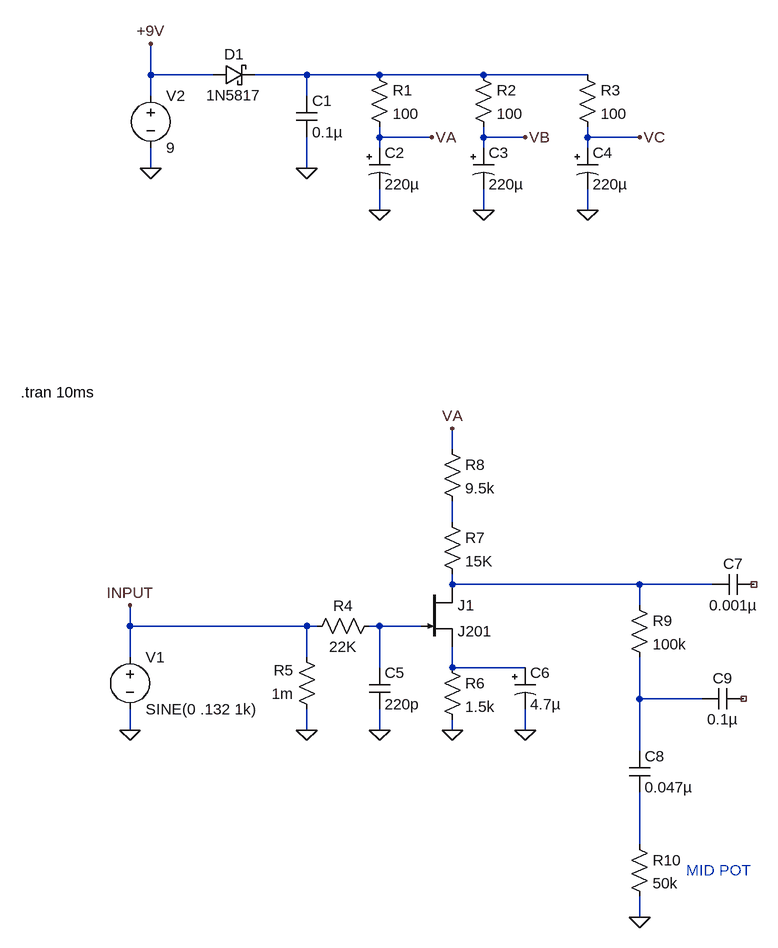
[diagram p0: schematic JM Fetzer Valve.asc]
JM Fetzer Valve.asc, the LTspice schematic file:
Version 4
SHEET 1 880 804
WIRE -640 -512 -640 -560
WIRE -544 -512 -640 -512
WIRE -400 -512 -480 -512
WIRE -288 -512 -400 -512
WIRE -128 -512 -288 -512
WIRE 32 -512 -128 -512
WIRE -640 -480 -640 -512
WIRE -400 -480 -400 -512
WIRE -288 -416 -288 -432
WIRE -208 -416 -288 -416
WIRE -128 -416 -128 -432
WIRE -64 -416 -128 -416
WIRE 32 -416 32 -432
WIRE 112 -416 32 -416
WIRE -288 -400 -288 -416
WIRE -128 -400 -128 -416
WIRE 32 -400 32 -416
WIRE -640 -368 -640 -400
WIRE -400 -368 -400 -416
WIRE -288 -304 -288 -336
WIRE -128 -304 -128 -336
WIRE 32 -304 32 -336
WIRE -176 64 -176 32
WIRE -176 176 -176 144
WIRE -176 272 -176 256
WIRE 112 272 -176 272
WIRE 224 272 112 272
WIRE 112 304 112 272
WIRE -672 336 -672 304
WIRE -400 336 -672 336
WIRE -384 336 -400 336
WIRE -288 336 -304 336
WIRE -224 336 -288 336
WIRE -672 384 -672 336
WIRE -400 384 -400 336
WIRE -288 400 -288 336
WIRE -176 400 -176 368
WIRE -64 400 -176 400
WIRE 112 448 112 384
WIRE 208 448 112 448
WIRE -672 496 -672 464
WIRE -400 496 -400 464
WIRE -288 496 -288 464
WIRE -176 496 -176 480
WIRE -64 496 -64 464
WIRE 112 528 112 448
WIRE 112 672 112 592
WIRE 112 784 112 752
FLAG -672 496 0
FLAG -640 -368 0
FLAG -640 -560 +9V
FLAG -672 304 INPUT
FLAG -400 -368 0
FLAG -288 -304 0
FLAG -128 -304 0
FLAG 32 -304 0
FLAG -208 -416 VA
FLAG -64 -416 VB
FLAG 112 -416 VC
FLAG -400 496 0
FLAG -288 496 0
FLAG -176 496 0
FLAG -64 496 0
FLAG -176 32 VA
FLAG 112 784 0
SYMBOL voltage -672 368 R0
WINDOW 123 0 0 Left 0
WINDOW 39 0 0 Left 0
SYMATTR InstName V1
SYMATTR Value SINE(0 .132 1k)
SYMBOL voltage -640 -496 R0
WINDOW 123 0 0 Left 0
WINDOW 39 0 0 Left 0
SYMATTR InstName V2
SYMATTR Value 9
SYMBOL schottky -544 -496 R270
WINDOW 0 32 32 VTop 2
WINDOW 3 0 32 VBottom 2
SYMATTR InstName D1
SYMATTR Value 1N5817
SYMATTR Description Diode
SYMATTR Type diode
SYMBOL cap -416 -480 R0
SYMATTR InstName C1
SYMATTR Value 0.1µ
SYMATTR SpiceLine V=50 Irms=835m Rser=0.0936732 Lser=0 mfg="KEMET" pn="C1812C104K5RAC" type="X7R"
SYMBOL polcap -304 -400 R0
WINDOW 3 24 56 Left 2
SYMATTR InstName C2
SYMATTR Value 220µ
SYMATTR Description Capacitor
SYMATTR Type cap
SYMATTR SpiceLine V=35 Irms=570m Rser=0.123 Lser=20.8n mfg="Würth Elektronik" pn="865080553014 WCAP-ASLI 8x10,5" type="Al electrolytic"
SYMBOL polcap -144 -400 R0
WINDOW 3 24 56 Left 2
SYMATTR InstName C3
SYMATTR Value 220µ
SYMATTR Description Capacitor
SYMATTR Type cap
SYMATTR SpiceLine V=35 Irms=570m Rser=0.123 Lser=20.8n mfg="Würth Elektronik" pn="865080553014 WCAP-ASLI 8x10,5" type="Al electrolytic"
SYMBOL polcap 16 -400 R0
WINDOW 3 24 56 Left 2
SYMATTR InstName C4
SYMATTR Value 220µ
SYMATTR Description Capacitor
SYMATTR Type cap
SYMATTR SpiceLine V=35 Irms=570m Rser=0.123 Lser=20.8n mfg="Würth Elektronik" pn="865080553014 WCAP-ASLI 8x10,5" type="Al electrolytic"
SYMBOL res -304 -528 R0
SYMATTR InstName R1
SYMATTR Value 100
SYMATTR SpiceLine tol=1 pwr=0.125
SYMBOL res -144 -528 R0
SYMATTR InstName R2
SYMATTR Value 100
SYMATTR SpiceLine tol=1 pwr=0.125
SYMBOL res 16 -528 R0
SYMATTR InstName R3
SYMATTR Value 100
SYMATTR SpiceLine tol=1 pwr=0.125
SYMBOL njf -224 272 R0
SYMATTR InstName J1
SYMATTR Value J201
SYMBOL res -288 320 R90
WINDOW 0 0 56 VBottom 2
WINDOW 3 32 56 VTop 2
SYMATTR InstName R4
SYMATTR Value 22K
SYMATTR SpiceLine tol=1 pwr=0.1
SYMBOL res -384 480 R180
WINDOW 0 36 76 Left 2
WINDOW 3 36 40 Left 2
SYMATTR InstName R5
SYMATTR Value 1m
SYMBOL cap -304 400 R0
SYMATTR InstName C5
SYMATTR Value 220p
SYMATTR SpiceLine V=25 Irms=0 Rser=0.5863 Lser=330p mfg="Würth Elektronik" pn="885012206055 WCAP-CSGP 0603" type="X7R"
SYMBOL res -192 384 R0
SYMATTR InstName R6
SYMATTR Value 1.5k
SYMATTR SpiceLine tol=1 pwr=0.1
SYMBOL polcap -80 400 R0
WINDOW 3 24 56 Left 2
SYMATTR InstName C6
SYMATTR Value 4.7µ
SYMATTR Description Capacitor
SYMATTR Type cap
SYMATTR SpiceLine V=16 Irms=12m Rser=2.7041 Lser=1.39n mfg="Würth Elektronik" pn="865250340002 WCAP-ASNP 4x5,5" type="Al electrolytic"
SYMBOL res -192 160 R0
SYMATTR InstName R7
SYMATTR Value 15K
SYMATTR SpiceLine tol=1 pwr=0.1
SYMBOL res -192 48 R0
SYMATTR InstName R8
SYMATTR Value 9.5k
SYMBOL res 96 288 R0
SYMATTR InstName R9
SYMATTR Value 100k
SYMBOL cap 288 256 R90
WINDOW 0 0 32 VBottom 2
WINDOW 3 32 32 VTop 2
SYMATTR InstName C7
SYMATTR Value 0.001µ
SYMATTR SpiceLine V=25 Irms=0 Rser=0.2145 Lser=153p mfg="Würth Elektronik" pn="885012205044 WCAP-CSGP 0402" type="X7R"
SYMBOL cap 96 528 R0
SYMATTR InstName C8
SYMATTR Value 0.047µ
SYMATTR SpiceLine V=100 Irms=659m Rser=0.0888324 Lser=0 mfg="KEMET" pn="C1825C473K1RAC" type="X7R"
SYMBOL cap 272 432 R90
WINDOW 0 0 32 VBottom 2
WINDOW 3 32 32 VTop 2
SYMATTR InstName C9
SYMATTR Value 0.1µ
SYMATTR SpiceLine V=25 Irms=2.1 Rser=0.0606238 Lser=0 mfg="KEMET" pn="C1210C104K3RAC" type="X7R"
SYMBOL res 96 656 R0
SYMATTR InstName R10
SYMATTR Value 50k
TEXT -840 -24 Left 2 !.tran 10ms
TEXT 184 712 Left 2 ;MID POT

The netlist it stands for:
* JM Fetzer Valve.asc
V1 INPUT 0 SINE(0 .132 1k)
V2 +9V 0 9
D1 +9V N001 1N5817
C1 N001 0 0.1µ V=50 Irms=835m Rser=0.0936732 Lser=0 mfg="KEMET" pn="C1812C104K5RAC" type="X7R"
C2 VA 0 220µ V=35 Irms=570m Rser=0.123 Lser=20.8n mfg="Würth Elektronik" pn="865080553014 WCAP-ASLI 8x10,5" type="Al electrolytic"
C3 VB 0 220µ V=35 Irms=570m Rser=0.123 Lser=20.8n mfg="Würth Elektronik" pn="865080553014 WCAP-ASLI 8x10,5" type="Al electrolytic"
C4 VC 0 220µ V=35 Irms=570m Rser=0.123 Lser=20.8n mfg="Würth Elektronik" pn="865080553014 WCAP-ASLI 8x10,5" type="Al electrolytic"
R1 N001 VA 100 tol=1 pwr=0.125
R2 N001 VB 100 tol=1 pwr=0.125
R3 N001 VC 100 tol=1 pwr=0.125
J1 N003 N004 N005 J201
R4 N004 INPUT 22K tol=1 pwr=0.1
R5 0 INPUT 1m
C5 N004 0 220p V=25 Irms=0 Rser=0.5863 Lser=330p mfg="Würth Elektronik" pn="885012206055 WCAP-CSGP 0603" type="X7R"
R6 N005 0 1.5k tol=1 pwr=0.1
C6 N005 0 4.7µ V=16 Irms=12m Rser=2.7041 Lser=1.39n mfg="Würth Elektronik" pn="865250340002 WCAP-ASNP 4x5,5" type="Al electrolytic"
R7 N002 N003 15K tol=1 pwr=0.1
R8 VA N002 9.5k
R9 N003 N006 100k
C7 NC_01 N003 0.001µ V=25 Irms=0 Rser=0.2145 Lser=153p mfg="Würth Elektronik" pn="885012205044 WCAP-CSGP 0402" type="X7R"
C8 N006 N007 0.047µ V=100 Irms=659m Rser=0.0888324 Lser=0 mfg="KEMET" pn="C1825C473K1RAC" type="X7R"
C9 NC_02 N006 0.1µ V=25 Irms=2.1 Rser=0.0606238 Lser=0 mfg="KEMET" pn="C1210C104K3RAC" type="X7R"
R10 N007 0 50k
.model D D
.lib standard.dio
.model NJF NJF
.model PJF PJF
.lib standard.jft
.tran 10ms
* MID POT
.backanno
.end